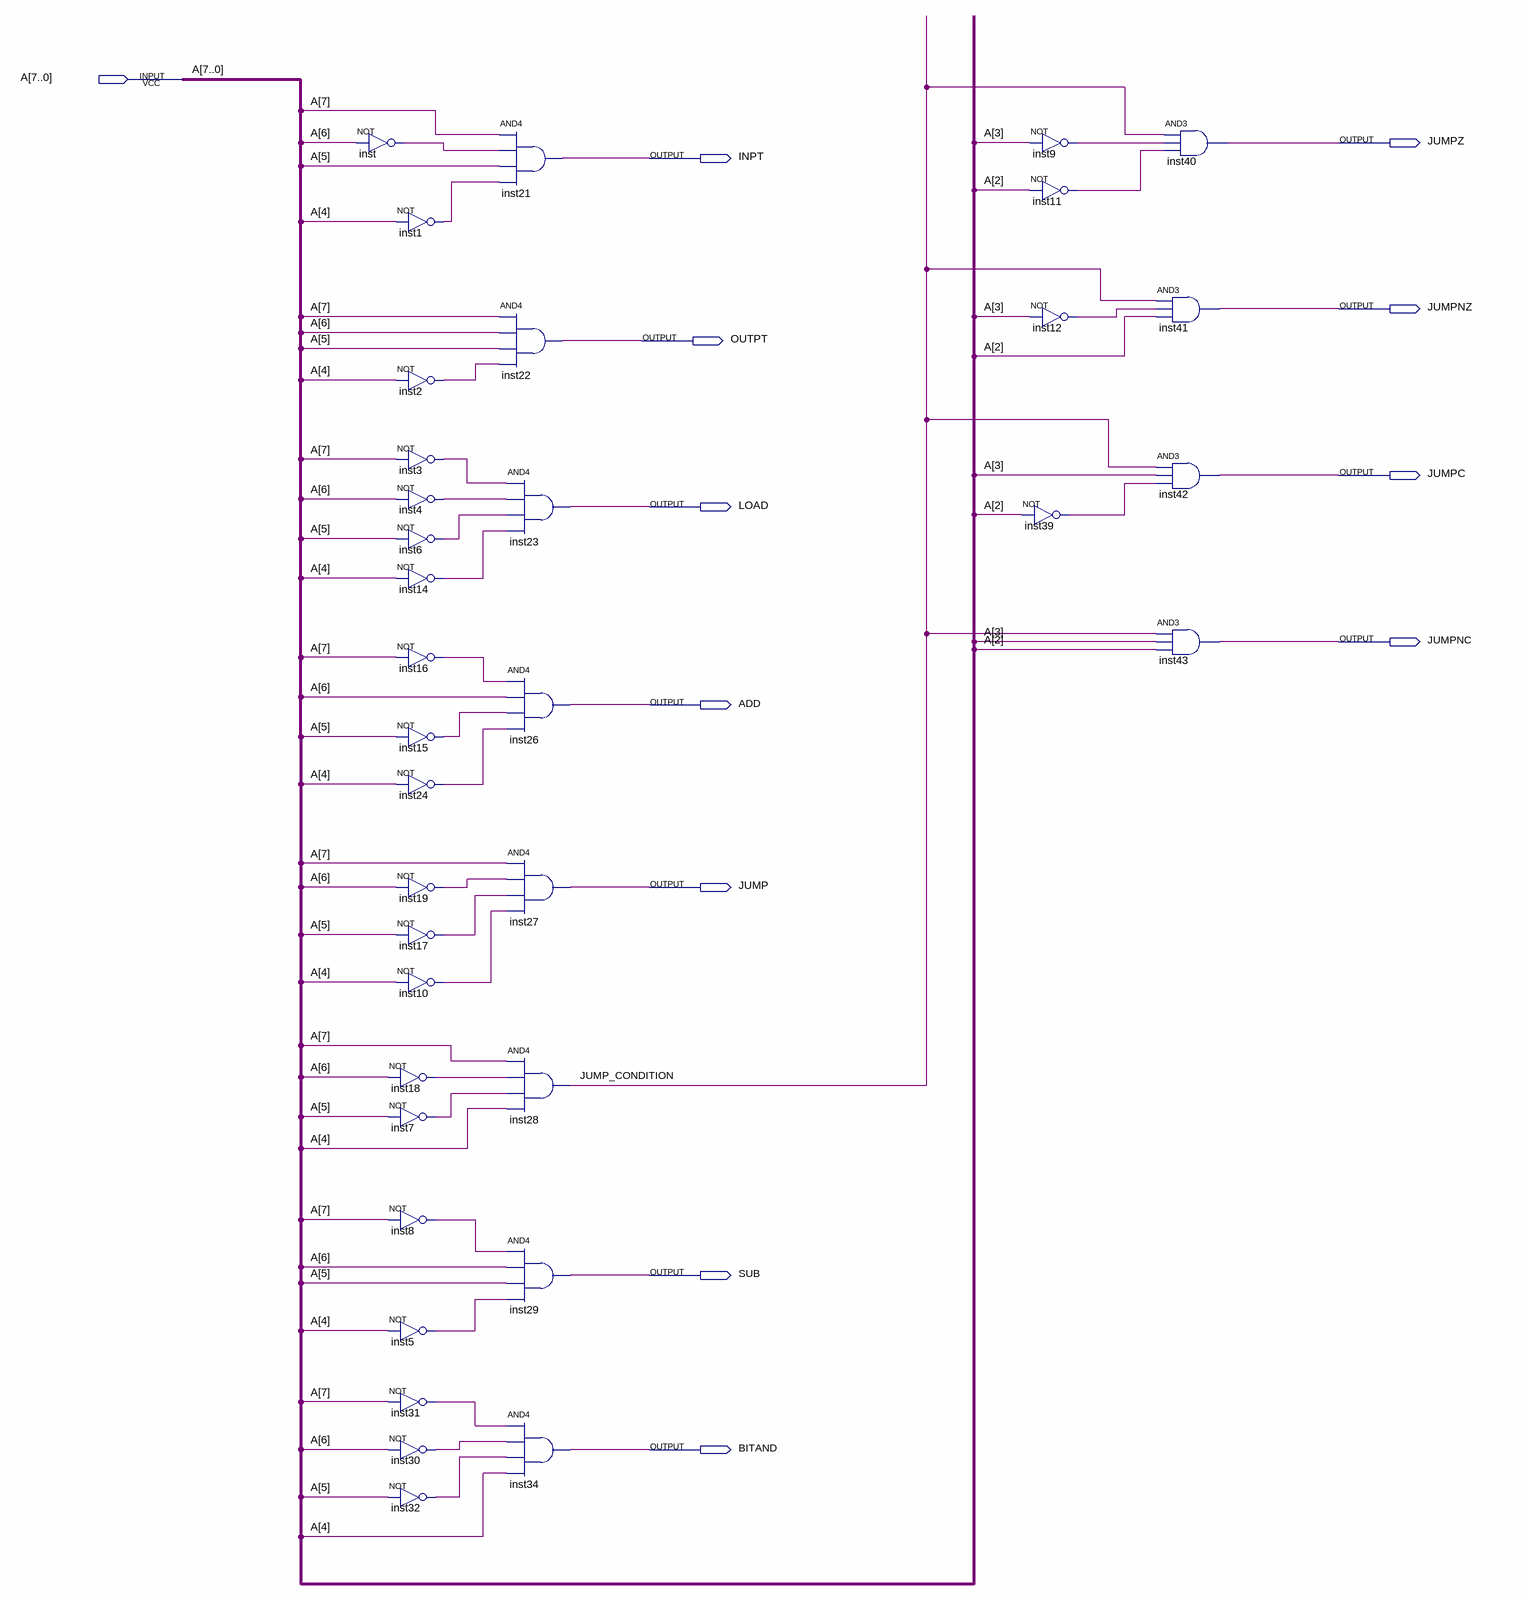
[diagram p0: schematic sheet]
// Quartus schematic instruction_decoder.bdf as structural Verilog: 36 symbols, 12 pins
module instruction_decoder (
  input  [7:0] A,
  output JUMPZ,
  output INPT,
  output JUMPNZ,
  output OUTPT,
  output JUMPC,
  output LOAD,
  output JUMPNC,
  output ADD,
  output JUMP,
  output SUB,
  output BITAND
);

  wire inst1_out, inst2_out, inst3_out, inst4_out, inst5_out, inst6_out, inst7_out, inst8_out, inst9_out,
       inst10_out, inst11_out, inst12_out, inst14_out, inst15_out, inst16_out, inst17_out, inst18_out,
       inst19_out, inst24_out, inst30_out, inst31_out, inst32_out, inst39_out, inst_out, JUMP_CONDITION;

  not inst (inst_out, A[6]);
  not inst1 (inst1_out, A[4]);
  not inst2 (inst2_out, A[4]);
  not inst3 (inst3_out, A[7]);
  not inst4 (inst4_out, A[6]);
  not inst6 (inst6_out, A[5]);
  not inst14 (inst14_out, A[4]);
  not inst16 (inst16_out, A[7]);
  not inst15 (inst15_out, A[5]);
  not inst24 (inst24_out, A[4]);
  not inst19 (inst19_out, A[6]);
  not inst17 (inst17_out, A[5]);
  not inst10 (inst10_out, A[4]);
  not inst18 (inst18_out, A[6]);
  not inst7 (inst7_out, A[5]);
  not inst8 (inst8_out, A[7]);
  not inst5 (inst5_out, A[4]);
  not inst31 (inst31_out, A[7]);
  not inst30 (inst30_out, A[6]);
  not inst32 (inst32_out, A[5]);
  and inst21 (INPT, A[7], inst_out, A[5], inst1_out);
  and inst22 (OUTPT, A[7], A[6], A[5], inst2_out);
  and inst23 (LOAD, inst3_out, inst4_out, inst6_out, inst14_out);
  and inst26 (ADD, inst16_out, A[6], inst15_out, inst24_out);
  and inst27 (JUMP, A[7], inst19_out, inst17_out, inst10_out);
  and inst28 (JUMP_CONDITION, A[7], inst18_out, inst7_out, A[4]);
  and inst29 (SUB, inst8_out, A[6], A[5], inst5_out);
  and inst34 (BITAND, inst31_out, inst30_out, inst32_out, A[4]);
  not inst9 (inst9_out, A[3]);
  not inst11 (inst11_out, A[2]);
  not inst12 (inst12_out, A[3]);
  not inst39 (inst39_out, A[2]);
  and inst40 (JUMPZ, JUMP_CONDITION, inst9_out, inst11_out);
  and inst41 (JUMPNZ, JUMP_CONDITION, inst12_out, A[2]);
  and inst42 (JUMPC, JUMP_CONDITION, A[3], inst39_out);
  and inst43 (JUMPNC, JUMP_CONDITION, A[3], A[2]);
endmodule
